# Altium schematic sheet Supply 5V to 3V3- Ams1117.SchDoc
size A
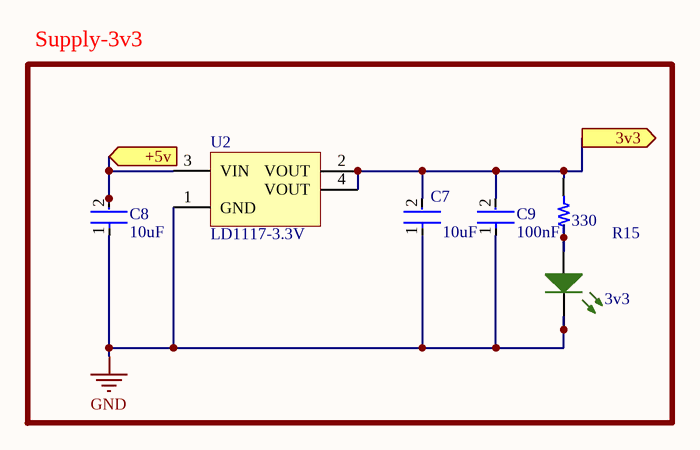
[diagram p0: Supply 5V to 3V3- Ams1117.SchDoc]

## Parts
3v3  LED SMD 0805 GREEN  [LED_0805_GREEN]  (value not drawn)
C7  10uF  [FP-C0805C-DN-MFG]
C8  10uF  [FP-C0805C-DN-IPC_B]
C9  100nF  [FP-C0805C-DN-IPC_B]
R15  330  [RES 0805_2012]
U2  LD1117-3.3V  [SOT-223-4 6.5X7MM P2.3MM]

## Blocks framed on the sheet
Supply-3v3: 3v3 C7-C9 R15 U2

## Ports
3v3 (out), +5v (in)

## Nets
GND: 3v3.2(K) C7.1 C8.1 C9.1 U2.1(GND)
3v3: C7.2 C9.2 R15.1 U2.2(VOUT) U2.4(VOUT) ; port 3v3
+5v: C8.2 U2.3(VIN) ; port +5v
Net3v3_1: 3v3.1(A) R15.2

## Library data of the parts
C7-C9 = CMP-1036-04552-2: CAP CER 0.22UF 50V X7R 0805; Manufacturer: KEMET; Manufacturer Part Number: C0805C224K5RACTU; Value: 0.22 μF; Temperature Coefficient: 30ppm/°C; Material: Ceramic; Tolerance: 0.1; ComponentLink2URL: https://content.kemet.com/datasheets/KEM_C1003_C0G_SMD.pdf; Temperature Characteristic: X7R; Device Class L3: Ceramic Capacitors; Lead Free: Yes; Temperature: -55°C to +125°C; RoHS: TRUE; Capacitance: 0.22 μF; Automotive: No; Octopart: https://octopart.com/c0805c224k5ractu-kemet-144670; Temperature Range Low: -55°C; Height: 0.88mm; Device Class L1: Passive Components; Digikey Description: CAP CER 0.22UF 50V X7R 0805; ComponentLink2Description: Datasheet; Mouser Description: CAP CER 0.22UF 50V X7R 0805; Category: Cap; Ipc Land Pattern Name: CAPC200125X78; Temperature Range High: +125°C; Package: C0805C-DN; Device Class L2: Capacitors; Voltage Rating: 50 V
R15 = Res 0805: SMT Resistor; VALUE: 1K
U2 = LD1117-3.3V (SMD SOT-223): Linear Voltage Regulator IC  1 Output  800mA SOT-223; PartNumber: LD1117S33CTR